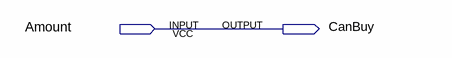
[diagram p0: schematic sheet]
// Quartus schematic CanBuy.bdf as structural Verilog: 0 symbols, 2 pins
module CanBuy (
  input  Amount,
  output CanBuy
);


  assign CanBuy = Amount;
endmodule
